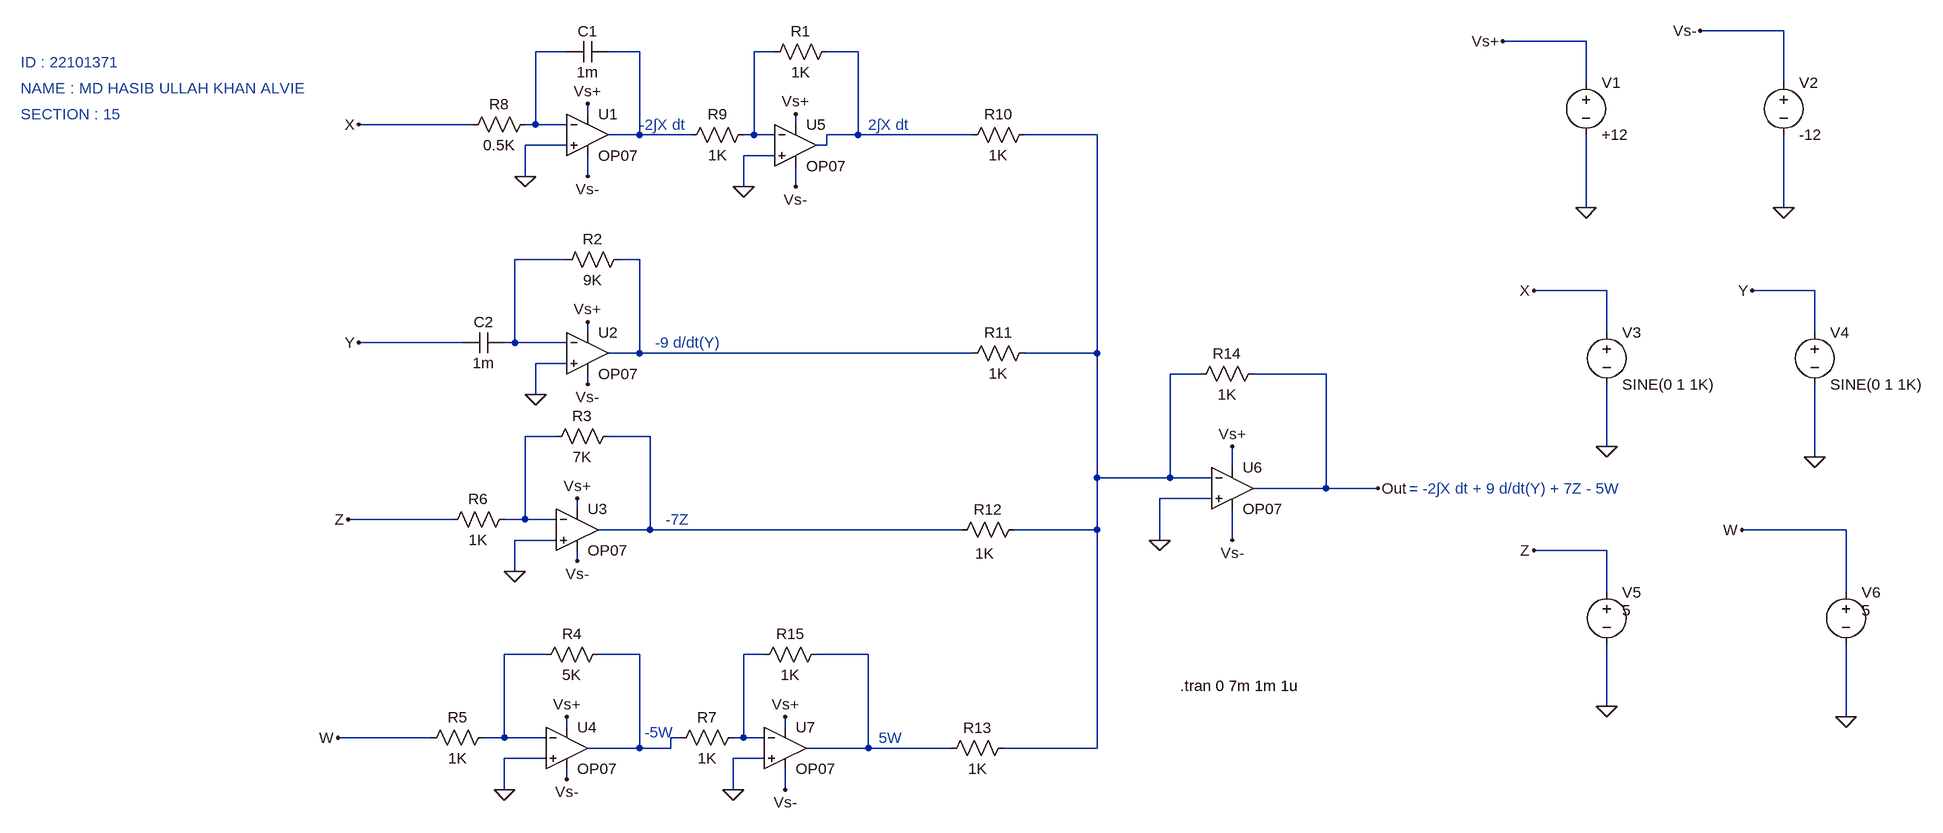
[diagram p0: schematic Project_22101371_Md Hasib Ullah Khan Alvie_251.asc]
Project_22101371_Md Hasib Ullah Khan Alvie_251.asc, the LTspice schematic file:
Version 4
SHEET 1 2064 884
WIRE 1776 -368 1648 -368
WIRE 1472 -352 1344 -352
WIRE -96 -336 -144 -336
WIRE 16 -336 -32 -336
WIRE 224 -336 192 -336
WIRE 352 -336 304 -336
WIRE 1472 -288 1472 -352
WIRE 1776 -288 1776 -368
WIRE -64 -240 -64 -256
WIRE -240 -224 -416 -224
WIRE -144 -224 -144 -336
WIRE -144 -224 -160 -224
WIRE -96 -224 -144 -224
WIRE 256 -224 256 -240
WIRE 16 -208 16 -336
WIRE 16 -208 -32 -208
WIRE 96 -208 16 -208
WIRE 192 -208 192 -336
WIRE 192 -208 176 -208
WIRE 224 -208 192 -208
WIRE 352 -208 352 -336
WIRE 352 -208 304 -208
WIRE 528 -208 352 -208
WIRE 720 -208 608 -208
WIRE -96 -192 -160 -192
WIRE 304 -192 304 -208
WIRE 304 -192 288 -192
WIRE 224 -176 176 -176
WIRE -160 -144 -160 -192
WIRE -64 -144 -64 -176
WIRE 176 -128 176 -176
WIRE 256 -128 256 -160
WIRE 1472 -96 1472 -208
WIRE 1776 -96 1776 -208
WIRE -96 -16 -176 -16
WIRE 16 -16 -16 -16
WIRE 1504 32 1392 32
WIRE 1824 32 1728 32
WIRE -64 96 -64 80
WIRE 1504 96 1504 32
WIRE 1824 96 1824 32
WIRE -256 112 -416 112
WIRE -176 112 -176 -16
WIRE -176 112 -192 112
WIRE -96 112 -176 112
WIRE 16 128 16 -16
WIRE 16 128 -32 128
WIRE 528 128 16 128
WIRE 720 128 720 -208
WIRE 720 128 608 128
WIRE -96 144 -144 144
WIRE 880 160 832 160
WIRE 1072 160 960 160
WIRE -64 176 -64 160
WIRE -144 192 -144 144
WIRE -112 256 -160 256
WIRE 32 256 -32 256
WIRE 1504 272 1504 176
WIRE 1824 288 1824 176
WIRE 928 304 928 272
WIRE 720 320 720 128
WIRE 832 320 832 160
WIRE 832 320 720 320
WIRE 896 320 832 320
WIRE 1072 336 1072 160
WIRE 1072 336 960 336
WIRE 1152 336 1072 336
WIRE 896 352 816 352
WIRE -80 368 -80 352
WIRE -272 384 -432 384
WIRE -160 384 -160 256
WIRE -160 384 -192 384
WIRE -112 384 -160 384
WIRE 32 400 32 256
WIRE 32 400 -48 400
WIRE 512 400 32 400
WIRE 720 400 720 320
WIRE 720 400 592 400
WIRE 1872 400 1712 400
WIRE -112 416 -176 416
WIRE 816 416 816 352
WIRE 928 416 928 368
WIRE 1504 432 1392 432
WIRE -80 448 -80 432
WIRE -176 464 -176 416
WIRE 1504 496 1504 432
WIRE 1872 496 1872 400
WIRE -128 592 -192 592
WIRE 16 592 -48 592
WIRE 208 592 176 592
WIRE 368 592 288 592
WIRE 1504 672 1504 576
WIRE 1872 688 1872 576
WIRE -96 704 -96 688
WIRE 240 704 240 688
WIRE -304 720 -448 720
WIRE -192 720 -192 592
WIRE -192 720 -224 720
WIRE -128 720 -192 720
WIRE 80 720 64 720
WIRE 176 720 176 592
WIRE 176 720 160 720
WIRE 208 720 176 720
WIRE 16 736 16 592
WIRE 16 736 -64 736
WIRE 64 736 64 720
WIRE 64 736 16 736
WIRE 368 736 368 592
WIRE 368 736 272 736
WIRE 496 736 368 736
WIRE 720 736 720 400
WIRE 720 736 576 736
WIRE -128 752 -192 752
WIRE 208 752 160 752
WIRE -96 784 -96 768
WIRE -192 800 -192 752
WIRE 160 800 160 752
WIRE 240 800 240 768
FLAG -416 -224 X
FLAG -416 112 Y
FLAG -432 384 Z
FLAG -448 720 W
FLAG -160 -144 0
FLAG -144 192 0
FLAG -176 464 0
FLAG -192 800 0
FLAG 176 -128 0
FLAG 816 416 0
FLAG 1152 336 Out
FLAG 160 800 0
FLAG -64 -256 Vs+
FLAG 256 -240 Vs+
FLAG -64 80 Vs+
FLAG -80 352 Vs+
FLAG -96 688 Vs+
FLAG 240 688 Vs+
FLAG 928 272 Vs+
FLAG -64 -144 Vs-
FLAG -64 176 Vs-
FLAG -80 448 Vs-
FLAG -96 784 Vs-
FLAG 240 800 Vs-
FLAG 256 -128 Vs-
FLAG 928 416 Vs-
FLAG 1344 -352 Vs+
FLAG 1648 -368 Vs-
FLAG 1392 32 X
FLAG 1728 32 Y
FLAG 1392 432 Z
FLAG 1712 400 W
FLAG 1472 -96 0
FLAG 1776 -96 0
FLAG 1504 272 0
FLAG 1824 288 0
FLAG 1504 672 0
FLAG 1872 688 0
SYMBOL OpAmps\\OP07 -64 -272 R0
SYMATTR InstName U1
SYMBOL OpAmps\\OP07 -64 64 R0
SYMATTR InstName U2
SYMBOL OpAmps\\OP07 -80 336 R0
SYMATTR InstName U3
SYMBOL OpAmps\\OP07 -96 672 R0
SYMATTR InstName U4
SYMBOL OpAmps\\OP07 256 -256 R0
SYMATTR InstName U5
SYMBOL OpAmps\\OP07 928 272 R0
SYMATTR InstName U6
SYMBOL res 0 -32 R90
WINDOW 0 0 56 VBottom 2
WINDOW 3 32 56 VTop 2
SYMATTR InstName R2
SYMATTR Value 9K
SYMBOL res -16 240 R90
WINDOW 0 0 56 VBottom 2
WINDOW 3 32 56 VTop 2
SYMATTR InstName R3
SYMATTR Value 7K
SYMBOL res -32 576 R90
WINDOW 0 0 56 VBottom 2
WINDOW 3 32 56 VTop 2
SYMATTR InstName R4
SYMATTR Value 5K
SYMBOL res -208 704 R90
WINDOW 0 0 56 VBottom 2
WINDOW 3 32 56 VTop 2
SYMATTR InstName R5
SYMATTR Value 1K
SYMBOL res -176 368 R90
WINDOW 0 0 56 VBottom 2
WINDOW 3 32 56 VTop 2
SYMATTR InstName R6
SYMATTR Value 1K
SYMBOL res -144 -240 R90
WINDOW 0 0 56 VBottom 2
WINDOW 3 32 56 VTop 2
SYMATTR InstName R8
SYMATTR Value 0.5K
SYMBOL res 192 -224 R90
WINDOW 0 0 56 VBottom 2
WINDOW 3 32 56 VTop 2
SYMATTR InstName R9
SYMATTR Value 1K
SYMBOL res 624 -224 R90
WINDOW 0 0 56 VBottom 2
WINDOW 3 32 56 VTop 2
SYMATTR InstName R10
SYMATTR Value 1K
SYMBOL res 624 112 R90
WINDOW 0 0 56 VBottom 2
WINDOW 3 32 56 VTop 2
SYMATTR InstName R11
SYMATTR Value 1K
SYMBOL res 608 384 R90
WINDOW 0 0 56 VBottom 2
WINDOW 3 37 61 VTop 2
SYMATTR InstName R12
SYMATTR Value 1K
SYMBOL res 592 720 R90
WINDOW 0 0 56 VBottom 2
WINDOW 3 32 56 VTop 2
SYMATTR InstName R13
SYMATTR Value 1K
SYMBOL res 976 144 R90
WINDOW 0 0 56 VBottom 2
WINDOW 3 32 56 VTop 2
SYMATTR InstName R14
SYMATTR Value 1K
SYMBOL cap -32 -352 R90
WINDOW 0 0 32 VBottom 2
WINDOW 3 32 32 VTop 2
SYMATTR InstName C1
SYMATTR Value 1m
SYMBOL cap -192 96 R90
WINDOW 0 0 32 VBottom 2
WINDOW 3 32 32 VTop 2
SYMATTR InstName C2
SYMATTR Value 1m
SYMBOL res 320 -352 R90
WINDOW 0 0 56 VBottom 2
WINDOW 3 32 56 VTop 2
SYMATTR InstName R1
SYMATTR Value 1K
SYMBOL OpAmps\\OP07 240 672 R0
SYMATTR InstName U7
SYMBOL res 176 704 R90
WINDOW 0 0 56 VBottom 2
WINDOW 3 32 56 VTop 2
SYMATTR InstName R7
SYMATTR Value 1K
SYMBOL res 304 576 R90
WINDOW 0 0 56 VBottom 2
WINDOW 3 32 56 VTop 2
SYMATTR InstName R15
SYMATTR Value 1K
SYMBOL voltage 1472 -304 R0
WINDOW 123 0 0 Left 0
WINDOW 39 0 0 Left 0
SYMATTR InstName V1
SYMATTR Value +12
SYMBOL voltage 1776 -304 R0
WINDOW 123 0 0 Left 0
WINDOW 39 0 0 Left 0
SYMATTR InstName V2
SYMATTR Value -12
SYMBOL voltage 1504 80 R0
WINDOW 123 0 0 Left 0
WINDOW 39 0 0 Left 0
SYMATTR InstName V3
SYMATTR Value SINE(0 1 1K)
SYMBOL voltage 1824 80 R0
WINDOW 123 0 0 Left 0
WINDOW 39 0 0 Left 0
SYMATTR InstName V4
SYMATTR Value SINE(0 1 1K)
SYMBOL voltage 1504 480 R0
WINDOW 3 24 44 Left 2
WINDOW 123 0 0 Left 0
WINDOW 39 0 0 Left 0
SYMATTR InstName V5
SYMATTR Value 5
SYMBOL voltage 1872 480 R0
WINDOW 3 24 44 Left 2
WINDOW 123 0 0 Left 0
WINDOW 39 0 0 Left 0
SYMATTR InstName V6
SYMATTR Value 5
TEXT -936 -320 Left 2 ;ID : 22101371
TEXT -936 -280 Left 2 ;NAME : MD HASIB ULLAH KHAN ALVIE
TEXT -936 -240 Left 2 ;SECTION : 15
TEXT 848 640 Left 2 !.tran 0 7m 1m 1u
TEXT 16 -224 Left 2 ;-2∫X dt
TEXT 40 112 Left 2 ;-9 d/dt(Y)
TEXT 56 384 Left 2 ;-7Z
TEXT 24 712 Left 2 ;-5W
TEXT 368 -224 Left 2 ;2∫X dt
TEXT 384 720 Left 2 ;5W
TEXT 1200 336 Left 2 ;= -2∫X dt + 9 d/dt(Y) + 7Z - 5W

The netlist it stands for:
* Project_22101371_Md Hasib Ullah Khan Alvie_251.asc
XU1 0 N001 Vs+ Vs- N002 LT1001  ; OP07, pins In+ In- V+ V- OUT
XU2 0 N006 Vs+ Vs- N007 LT1001  ; OP07, pins In+ In- V+ V- OUT
XU3 0 N008 Vs+ Vs- N009 LT1001  ; OP07, pins In+ In- V+ V- OUT
XU4 0 N010 Vs+ Vs- N011 LT1001  ; OP07, pins In+ In- V+ V- OUT
XU5 0 N003 Vs+ Vs- N004 LT1001  ; OP07, pins In+ In- V+ V- OUT
XU6 0 N005 Vs+ Vs- Out LT1001  ; OP07, pins In+ In- V+ V- OUT
R2 N007 N006 9K
R3 N009 N008 7K
R4 N011 N010 5K
R5 N010 W 1K
R6 N008 Z 1K
R8 N001 X 0.5K
R9 N003 N002 1K
R10 N005 N004 1K
R11 N005 N007 1K
R12 N005 N009 1K
R13 N005 N013 1K
R14 Out N005 1K
C1 N002 N001 1m
C2 N006 Y 1m
R1 N004 N003 1K
XU7 0 N012 Vs+ Vs- N013 LT1001  ; OP07, pins In+ In- V+ V- OUT
R7 N012 N011 1K
R15 N013 N012 1K
V1 Vs+ 0 +12
V2 Vs- 0 -12
V3 X 0 SINE(0 1 1K)
V4 Y 0 SINE(0 1 1K)
V5 Z 0 5
V6 W 0 5
* ID : 22101371
* NAME : MD HASIB ULLAH KHAN ALVIE
* SECTION : 15
.tran 0 7m 1m 1u
* -2∫X dt
* -9 d/dt(Y)
* -7Z
* -5W
* 2∫X dt
* 5W
* = -2∫X dt + 9 d/dt(Y) + 7Z - 5W
.lib LTC.lib
.backanno
.end